# Altium schematic sheet power.SchDoc
size A4; SheetNumber: 2; SheetTotal: 7
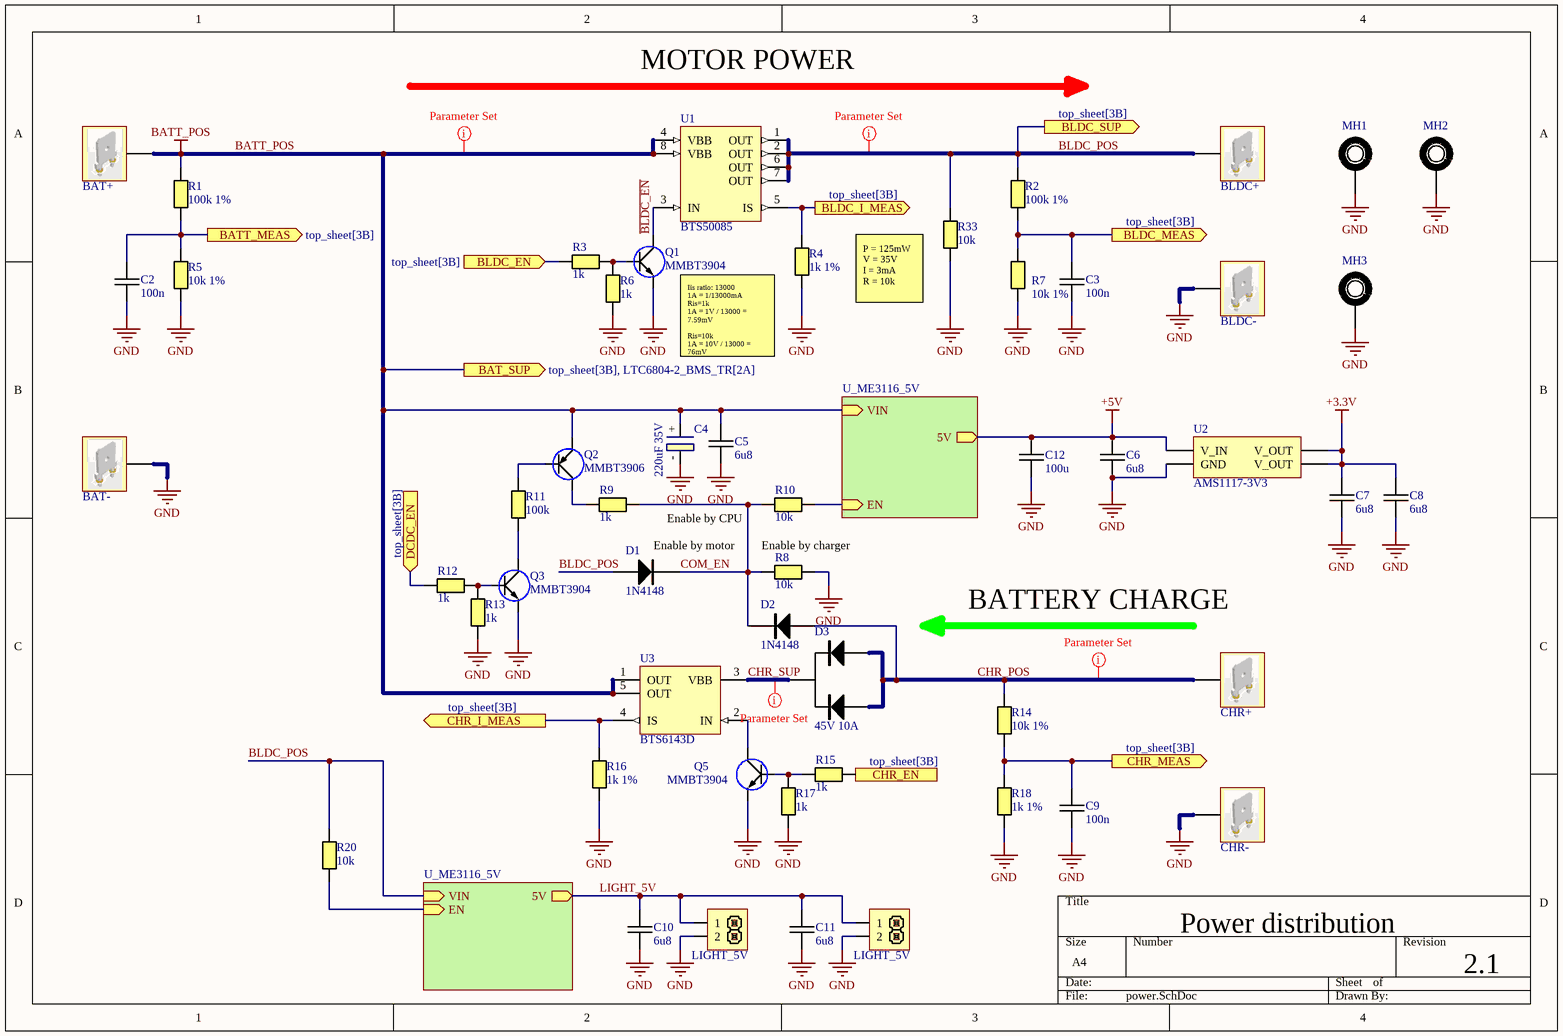
[diagram p0: power.SchDoc]

## Parts
BAT+  Crimp 6.3 single PCB  [Crimp 6.3mm single PCB]  (value not drawn)
BAT-  Crimp 6.3 single PCB  [Crimp 6.3mm single PCB]  (value not drawn)
BLDC+  Crimp 6.3 single PCB  [Crimp 6.3mm single PCB]  (value not drawn)
BLDC-  Crimp 6.3 single PCB  [Crimp 6.3mm single PCB]  (value not drawn)
C2  100n  [CAPC0603(1608)55_N]
C3  100n  [CAPC0603(1608)55_N]
C4  220uF 35V  [10x10.5 Capacitor]
C5  6u8  [CAPC0805(2012)75_N]
C6  6u8  [CAPC0805(2012)75_N]
C7  6u8  [CAPC0805(2012)75_N]
C8  6u8  [CAPC0805(2012)75_N]
C9  100n  [CAPC0603(1608)55_N]
C10  6u8  [CAPC0805(2012)75_N]
C11  6u8  [CAPC0805(2012)75_N]
C12  100u  [CAPC1206(3216)75_N]
CHR+  Crimp 6.3 single PCB  [Crimp 6.3mm single PCB]  (value not drawn)
CHR-  Crimp 6.3 single PCB  [Crimp 6.3mm single PCB]  (value not drawn)
CN1  PIN HEADER 1x2  [XH2.54 2P]  (value not drawn)
CN2  PIN HEADER 1x2  [XH2.54 2P]  (value not drawn)
D1  1N4148  [SOD80]
D2  1N4148  [SOD80]
D3  45V 10A  [DPAK]
MH1  Mounting Hole  [MH_M3]  (value not drawn)
MH2  Mounting Hole  [MH_M3]  (value not drawn)
MH3  Mounting Hole  [MH_M3]  (value not drawn)
Q1  MMBT3904  [SOT23]
Q2  MMBT3906  [SOT23]
Q3  MMBT3904  [SOT23]
Q5  MMBT3904  [SOT23]
R1  100k 1%  [RESC0603(1608)_N]
R2  100k 1%  [RESC0603(1608)_N]
R3  1k  [RESC0603(1608)_N]
R4  1k 1%  [RESC0603(1608)_N]
R5  10k 1%  [RESC0603(1608)_N]
R6  1k  [RESC0603(1608)_N]
R7  10k 1%  [RESC0603(1608)_N]
R8  10k  [RESC0603(1608)_N]
R9  1k  [RESC0603(1608)_N]
R10  10k  [RESC0603(1608)_N]
R11  100k  [RESC0603(1608)_N]
R12  1k  [RESC0603(1608)_N]
R13  1k  [RESC0603(1608)_N]
R14  10k 1%  [RESC0603(1608)_N]
R15  1k  [RESC0603(1608)_N]
R16  1k 1%  [RESC0603(1608)_N]
R17  1k  [RESC0603(1608)_N]
R18  1k 1%  [RESC0603(1608)_N]
R20  10k  [RESC0603(1608)_N]
R33  10k  [RESC0805(2012)_N]
U1  BTS50085  [PG-TO220-7-4]
U2  AMS1117-3V3  [SOT229P700X180-4N]
U3  BTS6143D  [ITO252-5-11_M]

## Sub-sheets
U_ME3116_5V = ME3116_5V: EN (in), VIN (in), 5V (out)
U_ME3116_5V = ME3116_5V: EN (in), VIN (in), 5V (out)

## Ports
BAT_SUP (out, see top_sheet[3B], LTC6804-2_BMS_TR[2A]), BATT_MEAS (out, see top_sheet[3B]), BLDC_EN (in, see top_sheet[3B]), BLDC_I_MEAS (out, see top_sheet[3B]), BLDC_MEAS (out, see top_sheet[3B]), BLDC_SUP (out, see top_sheet[3B]), CHR_EN (in, see top_sheet[3B]), CHR_I_MEAS (out, see top_sheet[3B]), CHR_MEAS (out, see top_sheet[3B]), DCDC_EN (in, see top_sheet[3B])

## Nets
+3.3V: C7.1 C8.1 U2.2(V_OUT) U2.4(V_OUT)
+5V: C6.1 C12.1 U2.3(V_IN) ; sheet U_ME3116_5V/5V
BATT_POS: BAT+.1 C4.+ C5.2 Q2.2(E) R1.2 U1.4(VBB) U1.8(VBB) U3.1(OUT) U3.5(OUT) ; port BAT_SUP, sheet U_ME3116_5V/VIN
GND: BAT-.1 BLDC-.1 C2.2 C3.2 C4.- C5.1 C6.2 C7.2 C8.2 C9.2 C10.2 C11.2 C12.2 CHR-.1 CN1.2 CN2.2 MH1.1 MH2.1 MH3.1 Q1.2(E) Q3.2(E) Q5.2(E) R4.1 R5.1 R6.1 R7.1 R8.2 R13.1 R16.1 R17.1 R18.1 R33.1 U2.1(GND)
~{BLDC_EN}: Q1.3(C) U1.3(IN)
BATT_MEAS: C2.1 R1.1 R5.2 ; port BATT_MEAS
BLDC_EN: R3.1 ; port BLDC_EN
BLDC_I_MEAS: R4.2 U1.5(IS) ; port BLDC_I_MEAS
BLDC_MEAS: C3.1 R2.1 R7.2 ; port BLDC_MEAS
BLDC_POS: BLDC+.1 D1.1(A) R2.2 R20.2 R33.2 U1.1(OUT) U1.2(OUT) U1.6(OUT) U1.7(OUT) ; port BLDC_SUP, sheet U_ME3116_5V/VIN
CHR_EN: R15.1 ; port CHR_EN
CHR_I_MEAS: R16.2 U3.4(IS) ; port CHR_I_MEAS
CHR_MEAS: C9.1 R14.1 R18.2 ; port CHR_MEAS
CHR_POS: CHR+.1 D2.1(A) D3.1(A1) D3.3(A2) R14.2
CHR_SUP: D3.2(K) U3.3(VBB)
COM_EN: D1.2(K) D2.2(K) R8.1 R9.1 R10.2
DCDC_EN: R12.1 ; port DCDC_EN
LIGHT_5V: C10.1 C11.1 CN1.1 CN2.1 ; sheet U_ME3116_5V/5V
NetQ1_1: Q1.1(B) R3.2 R6.2
NetQ2_1: Q2.1(B) R11.1
NetQ2_3: Q2.3(C) R9.2
NetQ3_1: Q3.1(B) R12.2 R13.2
NetQ3_3: Q3.3(C) R11.2
NetQ5_1: Q5.1(B) R15.2 R17.2
NetQ5_3: Q5.3(C) U3.2(IN)
NetR10_1: R10.1 ; sheet U_ME3116_5V/EN
NetR20_1: R20.1 ; sheet U_ME3116_5V/EN

## Layout directives
net class Direct; net class HV: BATT_POS, BLDC_POS, CHR_POS, CHR_SUP

## Notes on the sheet
- MOTOR POWER
- (near R33) P = 125mW
  V = 35V
  I = 3mA
  R = 10k
- Iis ratio: 13000
  1A = 1/13000mA
  Ris=1k
  1A = 1V / 13000 = 7.59mV
  Ris=10k
  1A = 10V / 13000 = 76mV
- Enable by CPU
- (near D1) Enable by motor
- Enable by charger
- BATTERY CHARGE
- Power distribution
- 2.1

## Library data of the parts
BAT+ BAT- BLDC+ BLDC- CHR+ CHR- = Crimp 6.3 single PCB: Straight Mount Angle PCB Tab Terminal
  BAT- BLDC- CHR-: ClassName: DirectGND
C2 C3 C5-C12 = Capacitor M: Ceramic capacitor Medium density
  C2 C3 C9: Value: 100n
  C5-C8 C10 C11: Value: 6u8
  C12: Value: 100u
C4 = Capacitor Electrolitic: Value: 220uF 35V
CN1 CN2 = PIN HEADER 2.54 1x2: LIGHT_5V; Parameter 1: LIGHT_5V
D1 D2 = 1N4148: Small Signal Fast Switching Diodes; Repetitive peak reverse voltage: 100 V; Reverse voltage: 75 V; Peak forward surge current: 2 A; Repetitive peak forward current: 500 mA; Forward continuous current: 300 mA; Average forward current: 150 mA; Diode capacitance: 4 pF; Reverse recovery time: 4 ~ 8 ns; Supplier 1: Mouser; Supplier Part Number 1: 78-MCL4148
D3 = STPS1045B: Power schottky rectifier; V: 45V; I: 10A
Q1 Q3 Q5 = 2N3904: NPN General Purpose Transistor; Collector-Emitter Voltage: 40V; Collector-Base Voltage: 60V; Collector Current - Continuous: 200mA; DC Current Gain: 300
Q2 = 2N3906: PNP General Purpose Transistor; Collector-Emitter Voltage: -40V; Collector-Base Voltage: -60V; Collector Current - Continuous: 200mA; DC Current Gain: 300
R1-R18 R20 R33 = Resistor M: Resistor Medium Density
  R1 R2: Value: 100k 1%
  R3 R6 R9 R12 R13 R15 R17: Value: 1k
  R4 R16 R18: Value: 1k 1%
  R5 R7 R14: Value: 10k 1%
  R8 R10 R20 R33: Value: 10k
  R11: Value: 100k
U1 = BTS50085-1TMA: Smart Highside High Current Power Switch; Overvoltage protection: 70V; Output clamp: 62V; Operating voltage: 5.0 .. 58V; On-state resistance: 9 mOhm; Load current (ISO): 44A; Short circuit current limitation: 90A; Current sense ratio: 13000
U2 = AMS1117: 800mA LDO  15V max
U3 = BTS6143D: PROFET Smart Highside Power Switch, 1 Channel, 10 A Load Current, -40 to 150 degC, PG-TO252-5-11, Reel, Green; Manufacturer: Infineon; Recommended Operating Voltage Min.: 5.5 V; RON(max) @ 150degreesC: 18 mOhm; toff (max): 500 us; Load Current (typ): 10 A; RON @ 25degreesC: 10 mOhm; Recommended Operating Voltage Max.: 38 V; Green: TRUE; Ptot (max): 59 W; Group: Automotive Qualified; Channels: 1; Packing: Reel; ComponentLink1URL: http://www.infineon.com/; PartNumber: BTS6143D; Mounting Technology: Surface Mount; ComponentLink2Description: Datasheet; ComponentLink3URL: http://www.infineon.com/dgdl/TLE7276-Data+Sheet-+v1_11.pdf?folderId=db3a304412b407950112b408e8c90004&fileId=db3a304412b407950112b436c53f66c8&sId=db3a30433db6f09f013dc0e43c0428c1; ComponentLink3Description: Package Specification; ComponentLink2URL: http://www.infineon.com/dgdl/BTS6143D_DS_v10.pdf?folderId=db3a304314dca389011537739e37155f&fileId=db3a3043183a95550118606a2705368e&location=en.Products.Automotive_ICs.Smart_High-_and_Low-Side_Switches.PROFET__-_Smart_High_Side_Switches.DATASHEET.BTS6143D_D; ComponentLink1Description: Manufacturer URL; PackageVersion: Nov-10; PackageDescription: 5-Pin Plastic (Green) Transistor Single Outline Package, 6.5 x 6.12 mm Body, 1.14 mm Pitch; Halogen-free: TRUE; DatasheetVersion: Rev. 1.0; PackageReference: PG-TO252-5-11; ton (max): 500 us
MH1-MH3 = Mounting Hole: ClassName: DirectGND